# Altium schematic sheet SAMD21_Xplained_Pro_triple_input_power_supply.SchDoc: Power supply
size A3; Organization: ATMEL Norway; Address1: Vestre Rosten 79; Address2: N-7075 TILLER; Address3: NORWAY; DocumentNumber: A09-2130; Revision: 2; SheetNumber: 2; SheetTotal: 5; PageSetup: Record=PageOptions|CenterHorizontal=True|CenterVertical=True|PrintScale=1.01|XCorrection=1.00|YCorrection=1.00|PrintKind=1|BorderSize=5000000|LeftOffset=0|BottomOffset=0|Orientation=2|PaperLength=1000|PaperWidth=1000|Scale=100|PaperSource=7|PrintQuality=-4|MediaType=1|DitherType=10|PaperKind=A3 (297 x 420 mm)|PrintScaleMode=1
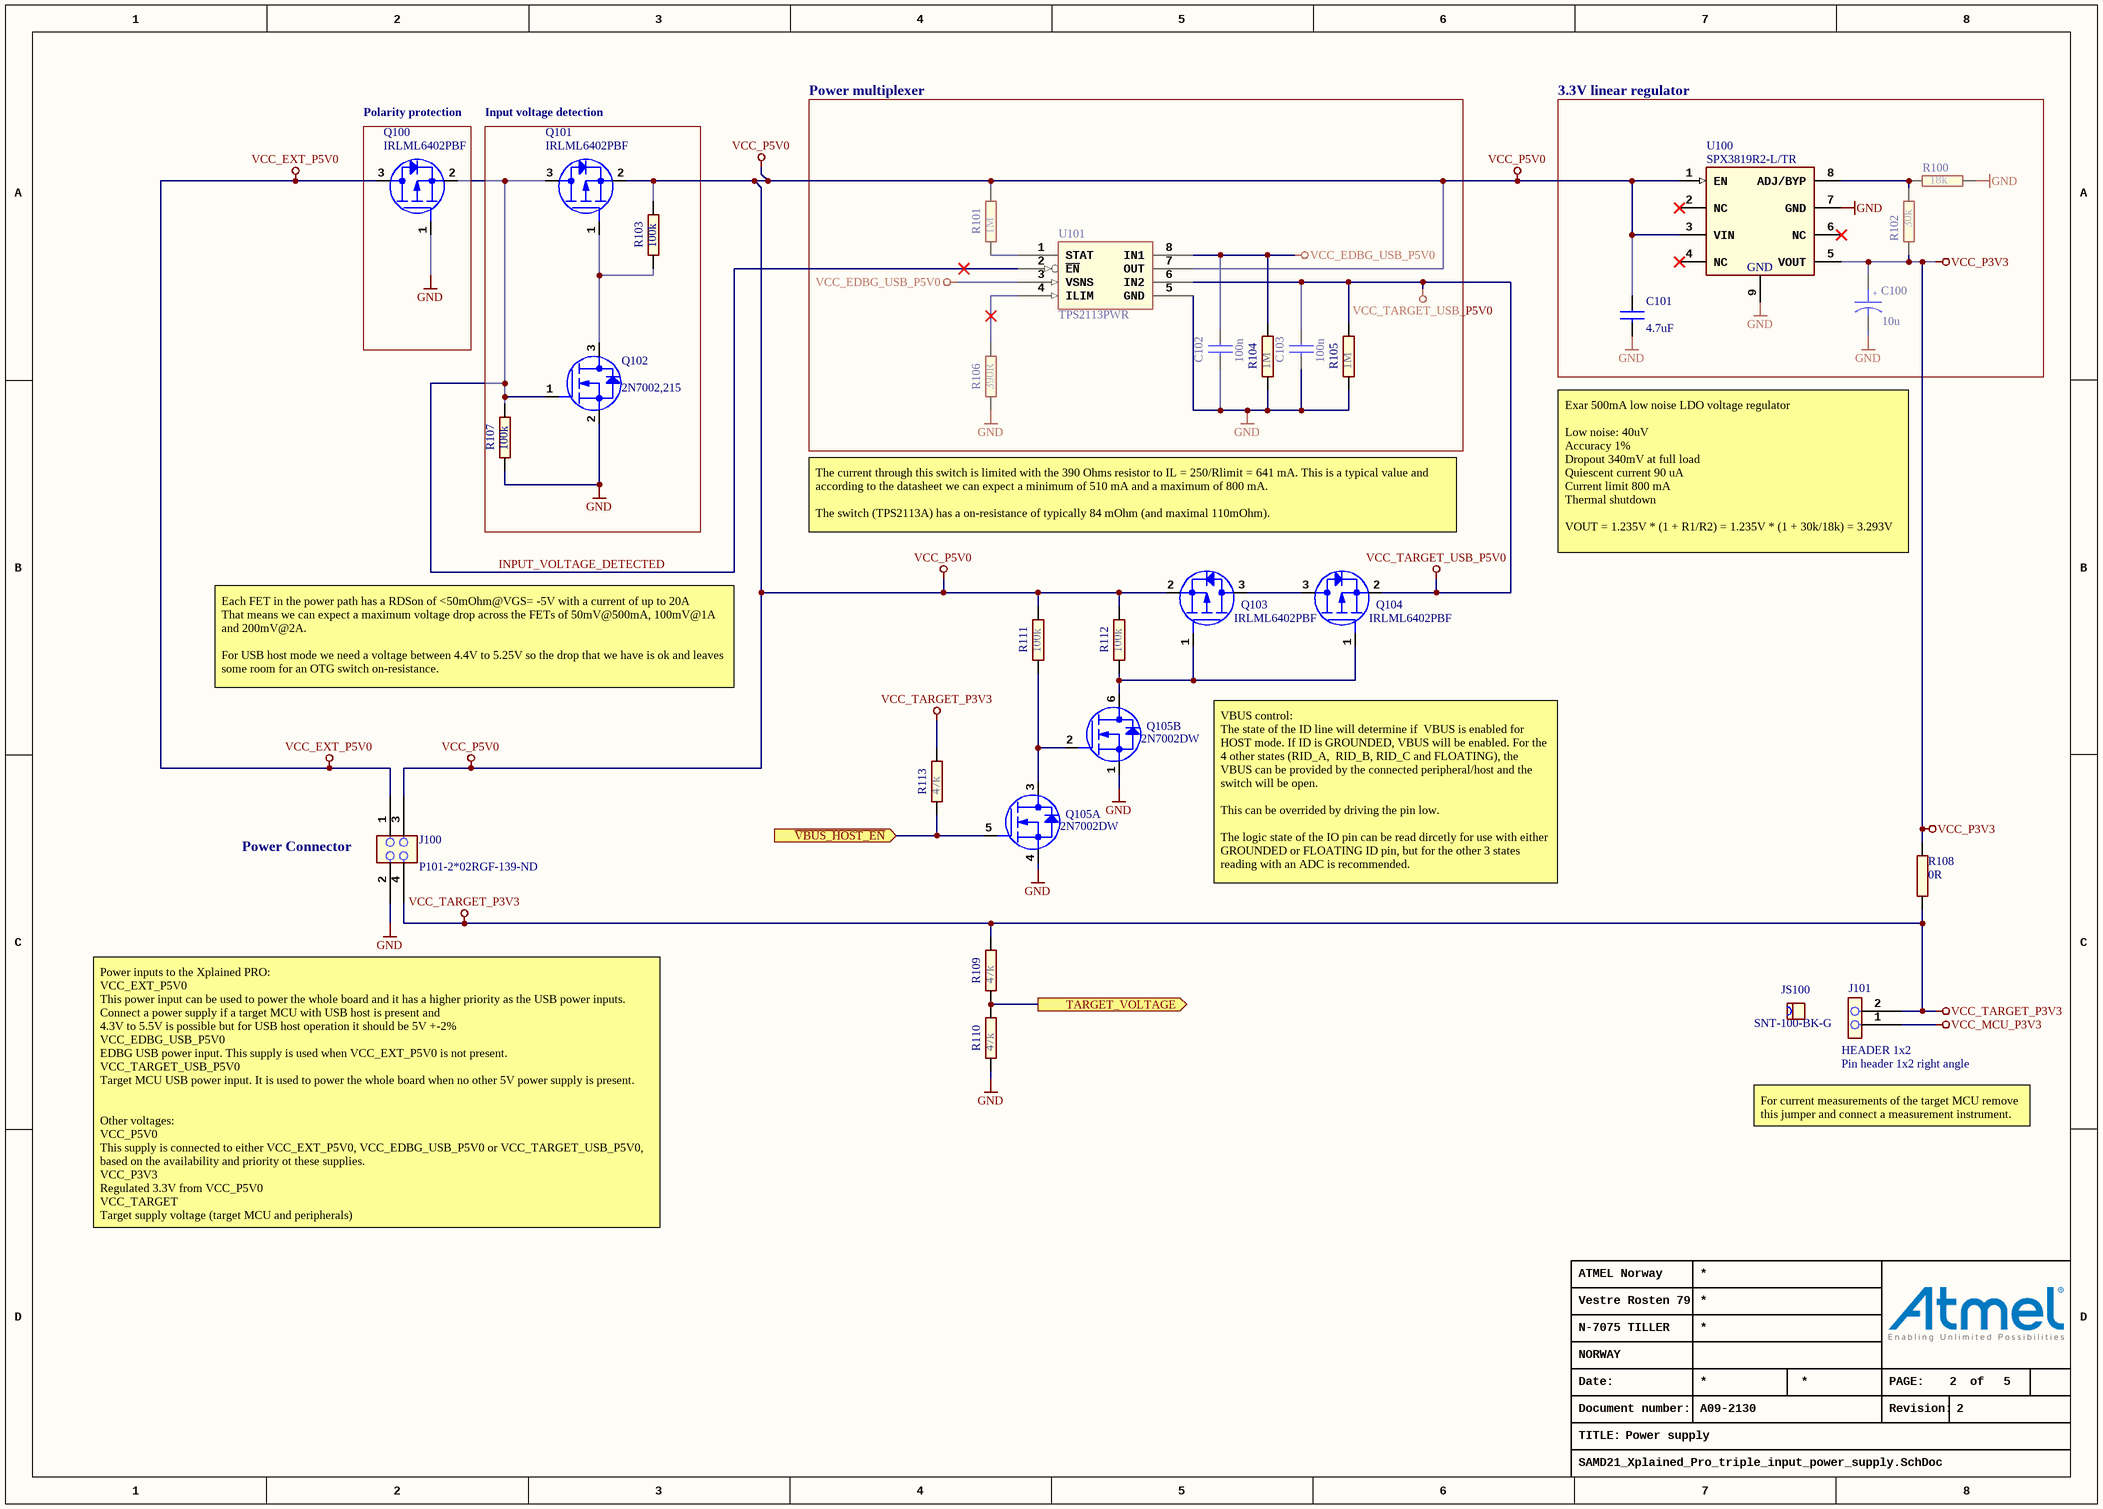
[diagram p0: SAMD21_Xplained_Pro_triple_input_power_supply.SchDoc]

## Parts
C100  value 10u  [AP1-00036]  (hidden comment: CAP-POL)
C101  value 4.7uF  [AP1-00039]  (hidden comment: CAP-NONPOL)
C102  value 100n  [AP1-00001]  (hidden comment: CAP-NONPOL)
C103  value 100n  [AP1-00001]  (hidden comment: CAP-NONPOL)
J100  value P101-2*02RGF-139-ND  [AP8-00628]  (hidden comment: HEADER 2x2)
J101  HEADER 1x2  value Pin header 1x2 right angle  [AP8-00367]
JS100  value SNT-100-BK-G  [AP8-00525]
Q100  value IRLML6402PBF  [AP5-00002]  (hidden comment: MOSFET_P_GSD)
Q101  value IRLML6402PBF  [AP5-00002]  (hidden comment: MOSFET_P_GSD)
Q102  value 2N7002,215  [AP5-00002]  (hidden comment: MOSFET_N_GSD)
Q103  value IRLML6402PBF  [AP5-00002]  (hidden comment: MOSFET_P_GSD)
Q104  value IRLML6402PBF  [AP5-00002]  (hidden comment: MOSFET_P_GSD)
Q105  value 2N7002DW  [AP5-00001]  (hidden comment: Same as 2N7002 but with two MOSFETs in one package)  (parts A,B of 2)
R100  value 18k  [AP2-00000]  (hidden comment: R2)
R101  value 1M  [AP2-00000]  (hidden comment: R2)
R102  value 30k  [AP2-00000]  (hidden comment: R2)
R103  value 100k  [AP2-00000]  (hidden comment: R2)
R104  value 1M  [AP2-00000]  (hidden comment: R2)
R105  value 1M  [AP2-00000]  (hidden comment: R2)
R106  value 390R  [AP2-00000]  (hidden comment: R2)
R107  value 100k  [AP2-00000]  (hidden comment: R2)
R108  value 0R  [AP2-00000]  (hidden comment: R2)
R109  value 47k  [AP2-00000]  (hidden comment: R2)
R110  value 47k  [AP2-00000]  (hidden comment: R2)
R111  value 100k  [AP2-00000]  (hidden comment: R2)
R112  value 100k  [AP2-00000]  (hidden comment: R2)
R113  value 47k  [AP2-00000]  (hidden comment: R2)
U100  value SPX3819R2-L/TR  [AP6-00338]  (hidden comment: Mouser: 1016-1588-2-ND)
U101  value TPS2113PWR  [AP6-00054]  (hidden comment: TPS2112)

## Blocks framed on the sheet
Polarity protection: Q100
Input voltage detection: Q101 Q102 R103 R107
Power multiplexer: C102 C103 R101 R104-R106 U101
3.3V linear regulator: C100 C101 R100 R102 U100

## Ports
TARGET_VOLTAGE (out), ~{VBUS_HOST_EN} (in)

## Nets
GND: C100.2 C101.2 C102.2 C103.2 J100.2 Q100.1(G) Q102.2(S) Q105.1(S2) Q105.4(S1) R100.2 R104.1 R105.1 R106.1 R107.1 R110.1 U100.7(GND) U100.9(GND) U101.5(GND)
VCC_EDBG_USB_P5V0: C102.1 R104.2 U101.3(VSNS) U101.8(IN1)
VCC_EXT_P5V0: J100.1 Q100.3(D)
VCC_MCU_P3V3: J101.1
VCC_P3V3: C100.1 R102.1 R108.1 U100.5(VOUT)
VCC_P5V0: C101.1 J100.3 Q101.2(S) Q103.2(S) R101.2 R103.2 R111.2 R112.1 U100.1(EN) U100.3(VIN) U101.7(OUT)
VCC_TARGET_P3V3: J100.4 J101.2 R108.2 R109.2 R113.2
VCC_TARGET_USB_P5V0: C103.1 Q104.2(S) R105.2 U101.6(IN2)
INPUT_VOLTAGE_DETECTED: Q100.2(S) Q101.3(D) Q102.1(G) R107.2 U101.2(~{EN})
TARGET_VOLTAGE: R109.1 R110.2 ; port TARGET_VOLTAGE
~{VBUS_HOST_EN}: Q105.5(G1) R113.1 ; port ~{VBUS_HOST_EN}
NetQ101_1: Q101.1(G) Q102.3(D) R103.1
NetQ103_1: Q103.1(G) Q104.1(G) Q105.6(D2) R112.2
NetQ103_3: Q103.3(D) Q104.3(D)
NetQ105_2: Q105.2(G2) Q105.3(D1) R111.1
NetR100_1: R100.1 R102.2 U100.8(ADJ/BYP)
NetR101_1: R101.1 U101.1(STAT)
NetR106_2: R106.2 U101.4(ILIM)

Not connected (* = marked no-connect by the designer): U100 2(NC)* 4(NC)* 6(NC)*

## Notes on the sheet
- The current through this switch is limited with the 390 Ohms resistor to IL = 250/Rlimit = 641 mA. This is a typical value and according to the datasheet we can expect a minimum of 510 mA and a maximum of 800 mA.
  The switch (TPS2113A) has a on-resistance of typically 84 mOhm (and maximal 110mOhm).
- Exar 500mA low noise LDO voltage regulator
  Low noise: 40uV
  Accuracy 1%
  Dropout 340mV at full load
  Quiescent current 90 uA
  Current limit 800 mA
  Thermal shutdown
  VOUT = 1.235V * (1 + R1/R2) = 1.235V * (1 + 30k/18k) = 3.293V
- Each FET in the power path has a RDSon of <50mOhm@VGS= -5V with a current of up to 20A
  That means we can expect a maximum voltage drop across the FETs of 50mV@500mA, 100mV@1A and 200mV@2A.
  For USB host mode we need a voltage between 4.4V to 5.25V so the drop that we have is ok and leaves some room for an OTG switch on-resistance.
- (near J100) Power Connector
- VBUS control:
  The state of the ID line will determine if  VBUS is enabled for HOST mode. If ID is GROUNDED, VBUS will be enabled. For the 4 other states (RID_A,  RID_B, RID_C and FLOATING), the VBUS can be provided by the connected peripheral/host and the switch will be open.
  This can be overrided by driving the pin low.
  The logic state of the IO pin can be read dircetly for use with either GROUNDED or FLOATING ID pin, but for the other 3 states reading with an ADC is recommended.
- For current measurements of the target MCU remove this jumper and connect a measurement instrument.
- Power inputs to the Xplained PRO:
  VCC_EXT_P5V0
  This power input can be used to power the whole board and it has a higher priority as the USB power inputs. Connect a power supply if a target MCU with USB host is present and
  4.3V to 5.5V is possible but for USB host operation it should be 5V +-2%
  VCC_EDBG_USB_P5V0
  EDBG USB power input. This supply is used when VCC_EXT_P5V0 is not present.
  VCC_TARGET_USB_P5V0
  Target MCU USB power input. It is used to power the whole board when no other 5V power supply is present.
  Other voltages:
  VCC_P5V0
  This supply is connected to either VCC_EXT_P5V0, VCC_EDBG_USB_P5V0 or VCC_TARGET_USB_P5V0, based on the availability and priority ot these supplies.
  VCC_P3V3
  Regulated 3.3V from VCC_P5V0
  VCC_TARGET
  Target supply voltage (target MCU and peripherals)
- Date:
- PAGE:
- of
- TITLE:
- Document number:
- Revision:
- (in symbol A01-0324) +

## Library data of the parts
C100 = A01-0324: SMD tantalum capacitor, ESR = 1.7, 3216-18 (EIA) 1206,; PartGroup: Capacitors,Tantalum; Manufacturer: vishay; MPN: TR3A106K016C1700; Tolerance: +-10%; TemperatureRange: -55°C ~ 85°C; AN: A01-0324; Height: 1.60000002384186
C101 = A01-0377: Ceramic capacitor, SMD 0603, X5R, 10V, 10% (de31036); PartGroup: Capacitors,Ceramic,SMD 0603; Manufacturer: tdk; MPN: C1608X5R1A475K; TemperatureRange: -55 - +85 deg C; AN: A01-0377; Tolerance: 10%; Height: 0.800000011920929
C102 C103 = A01-0246: Ceramic capacitor, SMD 0402, X7R, 16V, +/-10%; PartGroup: Capacitors,Ceramic,SMD 0402; Manufacturer: Kemet; MPN: C0402C104K4RACTU; TemperatureRange: -55 - +125 deg C; AN: A01-0246; Tolerance: 16V, +/-10%; Height: 0.5
J100 = A08-1519: Pin header, 2x2, Right Angle, 2.54mm, THT, Pin In Paste; PartGroup: Mechanical devices,Connectors,Pin headers; AN: A08-1519; Height: 5.07999992370605; MPN: P101-2*02RGF-139-ND
J101 = A08-0764: 1x2 pin header, right angle, 2.54 mm pitch, through-hole; PartGroup: Mechanical devices,Connectors,Pin headers; Manufacturer: Pro-data International Corp; MPN: 2213R-2G; AN: A08-0764; Height: 2.53999996185303
JS100 = A08-0543: Jumper cap for 2.54mm pinheader; PartGroup: Mechanical devices,Mounting accessories,Other; Manufacturer: SAMTEC; AN: A08-0543; MPN: SNT-100-BK-G
Q100 Q101 Q103 Q104 = A05-0087: P-ch. MOSFET. -30V, -3.7A continuous,RDS(ON)=0.05Ohm@VGS=-4,5V, RDS(ON)=0.08Ohm@VGS=-2.5V; PartGroup: Transistors,Power FET,SMD; Manufacturer: International Rectifier; TemperatureRange: -55 - +150 deg C; AN: A05-0087; Height: 1.14999997615814; MPN: IRLML6402PBF
Q102 = A05-0085: N-Channel MOSFET. 60V, 0.300A continuous, 1.2A Peak. RDS(ON) = 3.8Ohm@VGS=4.5V, VGS(th)<2.5V; PartGroup: Transistors,Small signal FET,SMD; Manufacturer: NXP; TemperatureRange: -65 to 150 deg C; AN: A05-0085; Height: 1.10000002384186; MPN: 2N7002,215
Q105 = A05-0051: Dual N-Channel MOSFET, 60V, 115mA cont,RDS(ON) < 7.5 Ohm @50mA@5V, SOT-363; PartGroup: Transistors,Small signal FET,SMD; Manufacturer: Fairchild; TemperatureRange: -65 to 150 deg C; AN: A05-0051; Height: 1,10000002384186; MPN: 2N7002DW
R100 = A02-0242: Thick film resistor, SMD 0402, 1/16W, 1%; PartGroup: Resistors,SMD,0402 1%; TemperatureRange: -55 - +125 deg C; AN: A02-0242; Tolerance: 1 %; Height: 0.349999994039536
R101 R104 R105 = A02-0284: Thick film resistor, SMD 0402, 1/16W, 1%; PartGroup: Resistors,SMD,0402 1%; TemperatureRange: -55 - +125 deg C; AN: A02-0284; Tolerance: 1 %; Height: 0.349999994039536
R102 = A02-0247: Thick film resistor, SMD 0402, 1/16W, 1%; PartGroup: Resistors,SMD,0402 1%; TemperatureRange: -55 - +125 deg C; AN: A02-0247; Tolerance: 1 %; Height: 0.349999994039536
R103 R107 = A02-0260: Thick film resistor, SMD 0402, 1/16W, 1%; PartGroup: Resistors,SMD,0402 1%; TemperatureRange: -55 - +125 deg C; AN: A02-0260; Tolerance: 1 %; Height: 0.349999994039536
R106 = A02-0202: Thick film resistor, SMD 0402, 1/16W, 1%; PartGroup: Resistors,SMD,0402 1%; TemperatureRange: -55 - +125 deg C; AN: A02-0202; Tolerance: 1 %; Height: 0.349999994039536
R108 = A02-0163: Thick film resistor, SMD 0402, 1/16W, 1%; PartGroup: Resistors,SMD,0402 1%; TemperatureRange: -55 - +125 deg C; AN: A02-0163; Tolerance: 1 %; Height: 0.349999994039536
R109 R110 R113 = A02-0252: Thick film resistor, SMD 0402, 1/16W, 1%; PartGroup: Resistors,SMD,0402 1%; TemperatureRange: -55 - +125 deg C; AN: A02-0252; Tolerance: 1 %; Height: 0.349999994039536
R111 R112 = A02-0260: Thick film resistor, SMD 0402, 1/16W, 1%; PartGroup: Resistors,SMD,0402 1%; TemperatureRange: -55ï¿½ to +125ï¿½C; AN: A02-0260; Tolerance: 1 %; Height: 0.349999994039536
U100 = A06-0957: 500mA LDO, ADJ, low noise, 8-DFN package; PartGroup: Integrated Circuits,Regulators,Linear; Manufacturer: Exar; Tolerance: ±1%; TemperatureRange: -40°C to +125°C; AN: A06-0957; Height: 0.899999976158142; MPN: SPX3819R2-L/TR
U101 = A06-0068: Autoswitching 2:1 Power Mux; PartGroup: Integrated Circuits,General linear,Analog switch, bus switch and MUX; Manufacturer: Texas Instruments; TemperatureRange: -40 - + 125 deg C; AN: A06-0068; Height: 1.20000004768372; MPN: TPS2113PWR